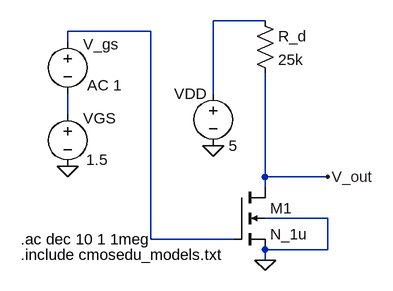
[diagram p0: schematic fonte comum.asc]
fonte comum.asc, the LTspice schematic file:
Version 4
SHEET 1 880 680
WIRE 256 -176 176 -176
WIRE 80 -160 -48 -160
WIRE -48 -144 -48 -160
WIRE 176 -64 176 -176
WIRE -48 -32 -48 -64
WIRE 256 64 256 -96
WIRE 352 64 256 64
WIRE 256 80 256 64
WIRE 352 128 256 128
WIRE 80 160 80 -160
WIRE 208 160 80 160
WIRE 352 176 352 128
WIRE 352 176 256 176
WIRE 256 192 256 176
FLAG 176 16 0
FLAG -48 48 0
FLAG 256 192 0
FLAG 352 64 V_out
SYMBOL nmos4 208 80 R0
SYMATTR InstName M1
SYMATTR Value N_1u
SYMATTR Value2 l=1.5u w=3u
SYMBOL voltage 176 -80 R0
WINDOW 0 -60 16 Left 2
WINDOW 123 0 0 Left 2
WINDOW 39 0 0 Left 2
SYMATTR InstName VDD
SYMATTR Value 5
SYMBOL voltage -48 -160 R0
WINDOW 123 30 83 Left 2
WINDOW 39 0 0 Left 2
WINDOW 0 24 20 Left 2
SYMATTR Value2 AC 1
SYMATTR InstName V_gs
SYMATTR Value ""
SYMBOL voltage -48 -48 R0
WINDOW 123 0 0 Left 2
WINDOW 39 0 0 Left 2
WINDOW 0 24 22 Left 2
WINDOW 3 29 86 Left 2
SYMATTR InstName VGS
SYMATTR Value 1.5
SYMBOL res 240 -192 R0
SYMATTR InstName R_d
SYMATTR Value 25k
TEXT -120 184 Left 2 !.include cmosedu_models.txt
TEXT -120 160 Left 2 !.ac dec 10 1 1meg

The netlist it stands for:
* fonte comum.asc
M1 V_out N002 0 0 N_1u l=1.5u w=3u
VDD N001 0 5
V_gs N002 N003 AC 1
VGS N003 0 1.5
R_d N001 V_out 25k
.model NMOS NMOS
.model PMOS PMOS
.lib standard.mos
.include cmosedu_models.txt
.ac dec 10 1 1meg
.backanno
.end